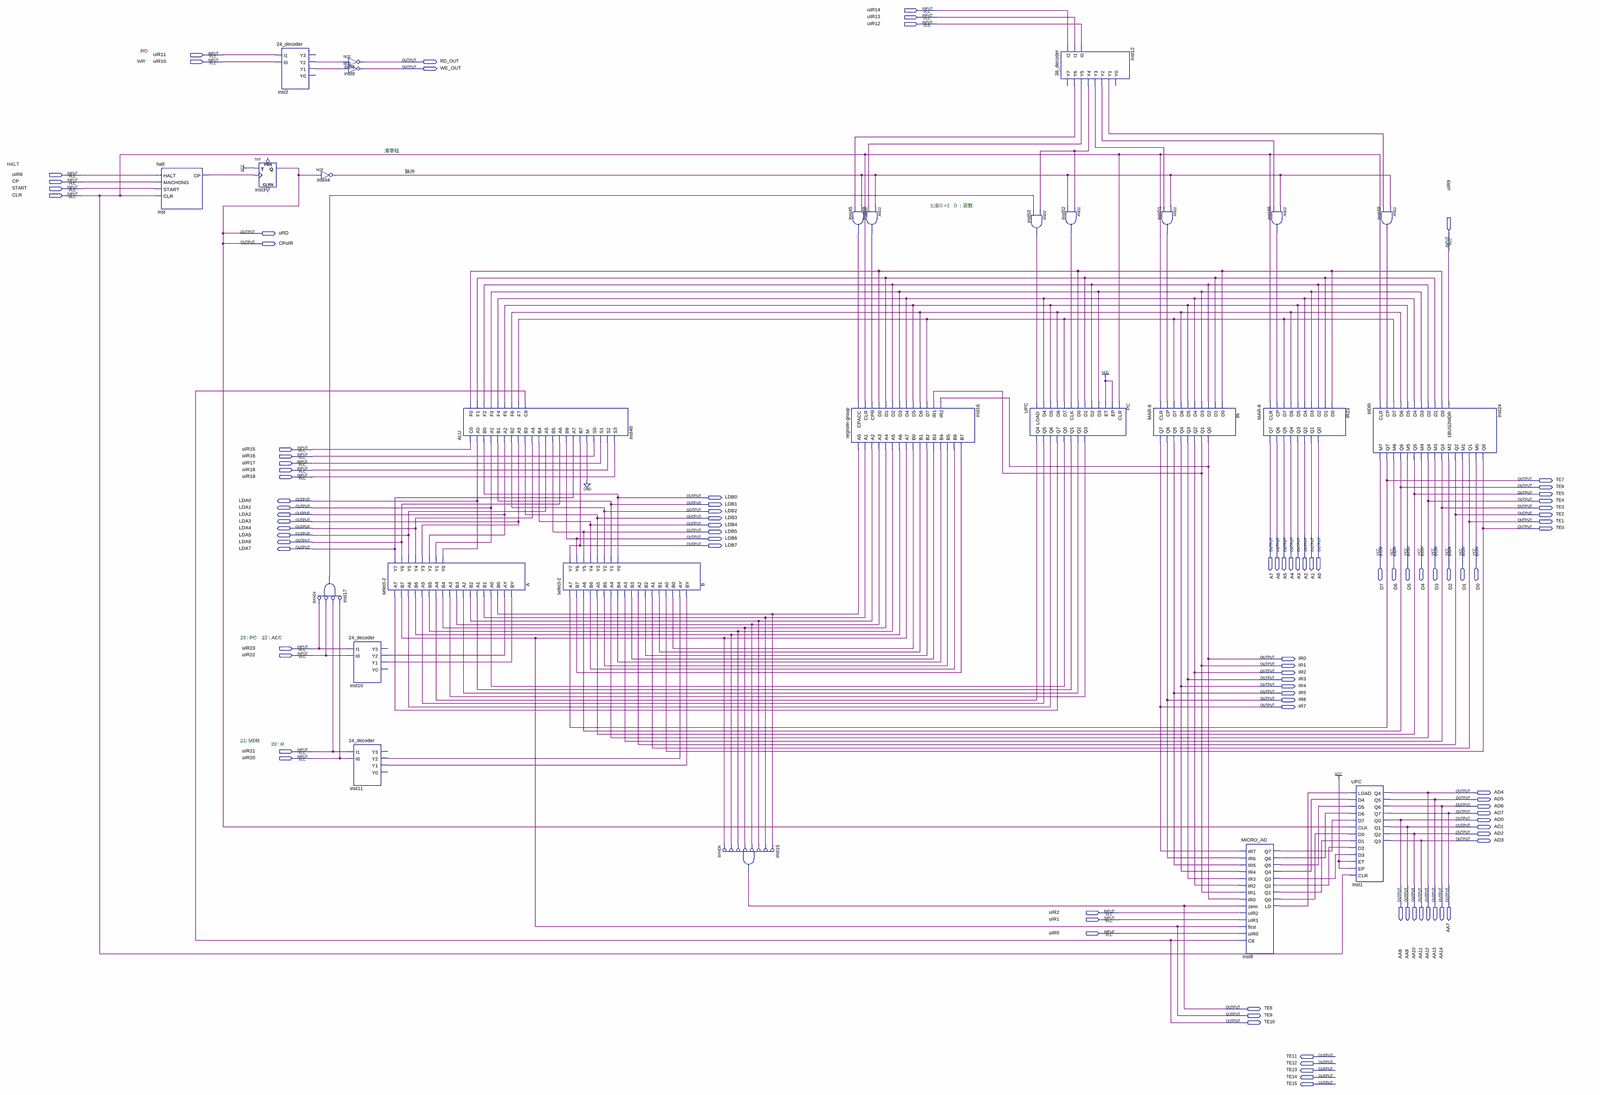
[diagram p0: schematic sheet, whole]
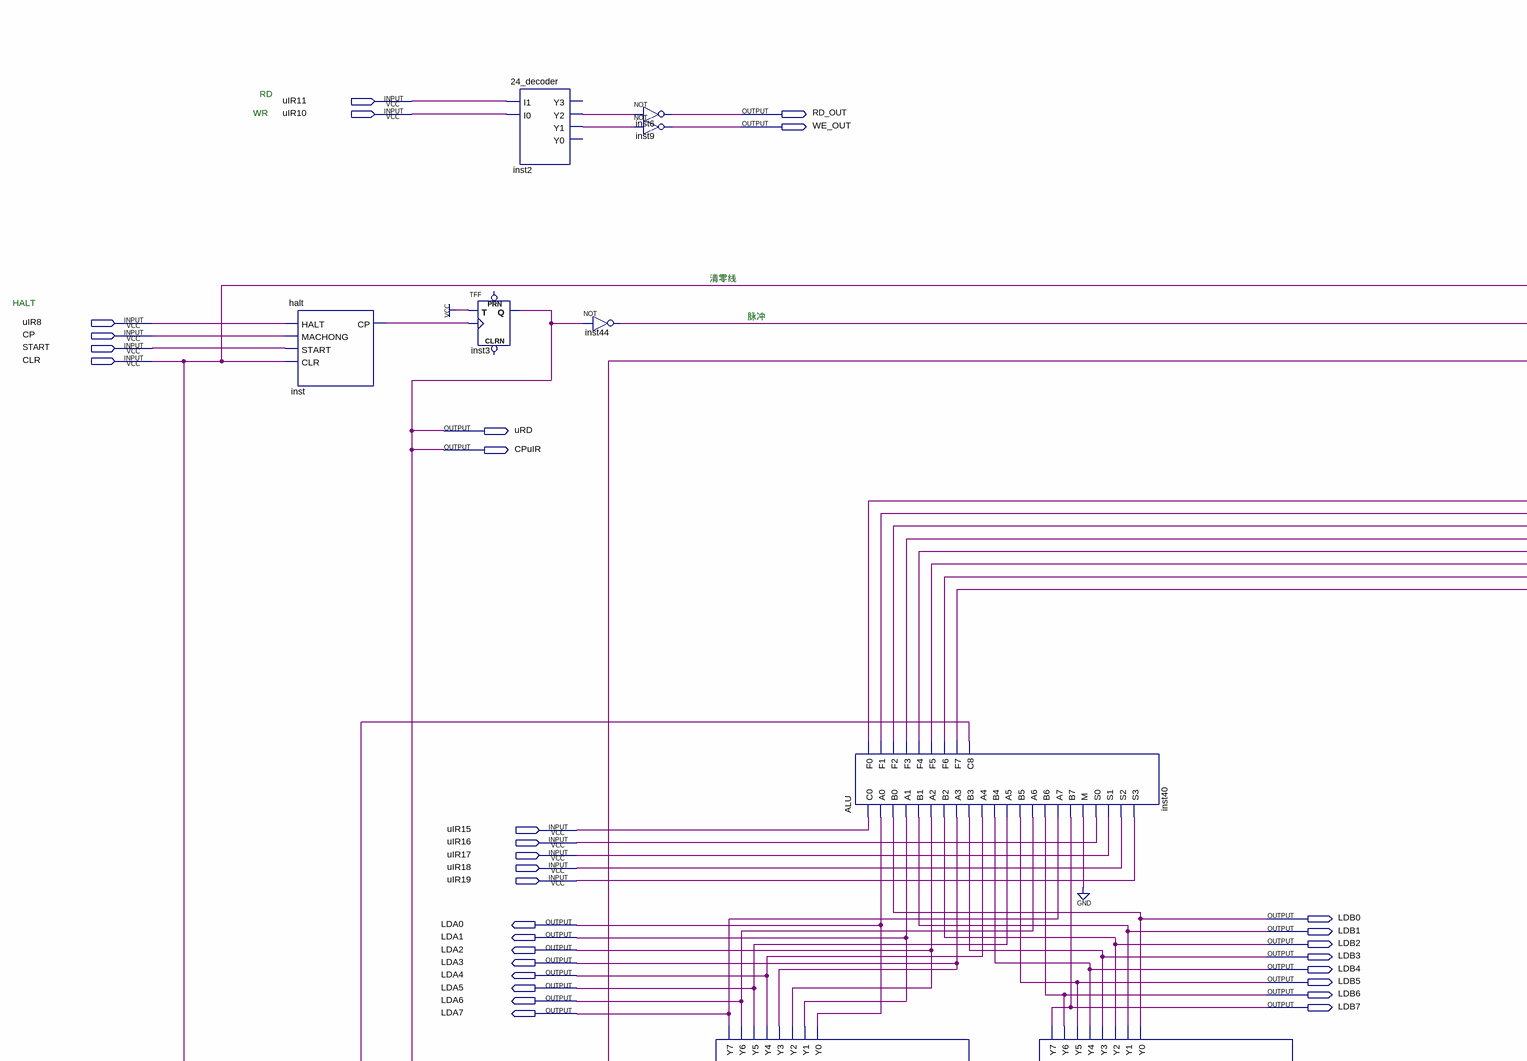
[diagram p1: schematic sheet, upper left part]
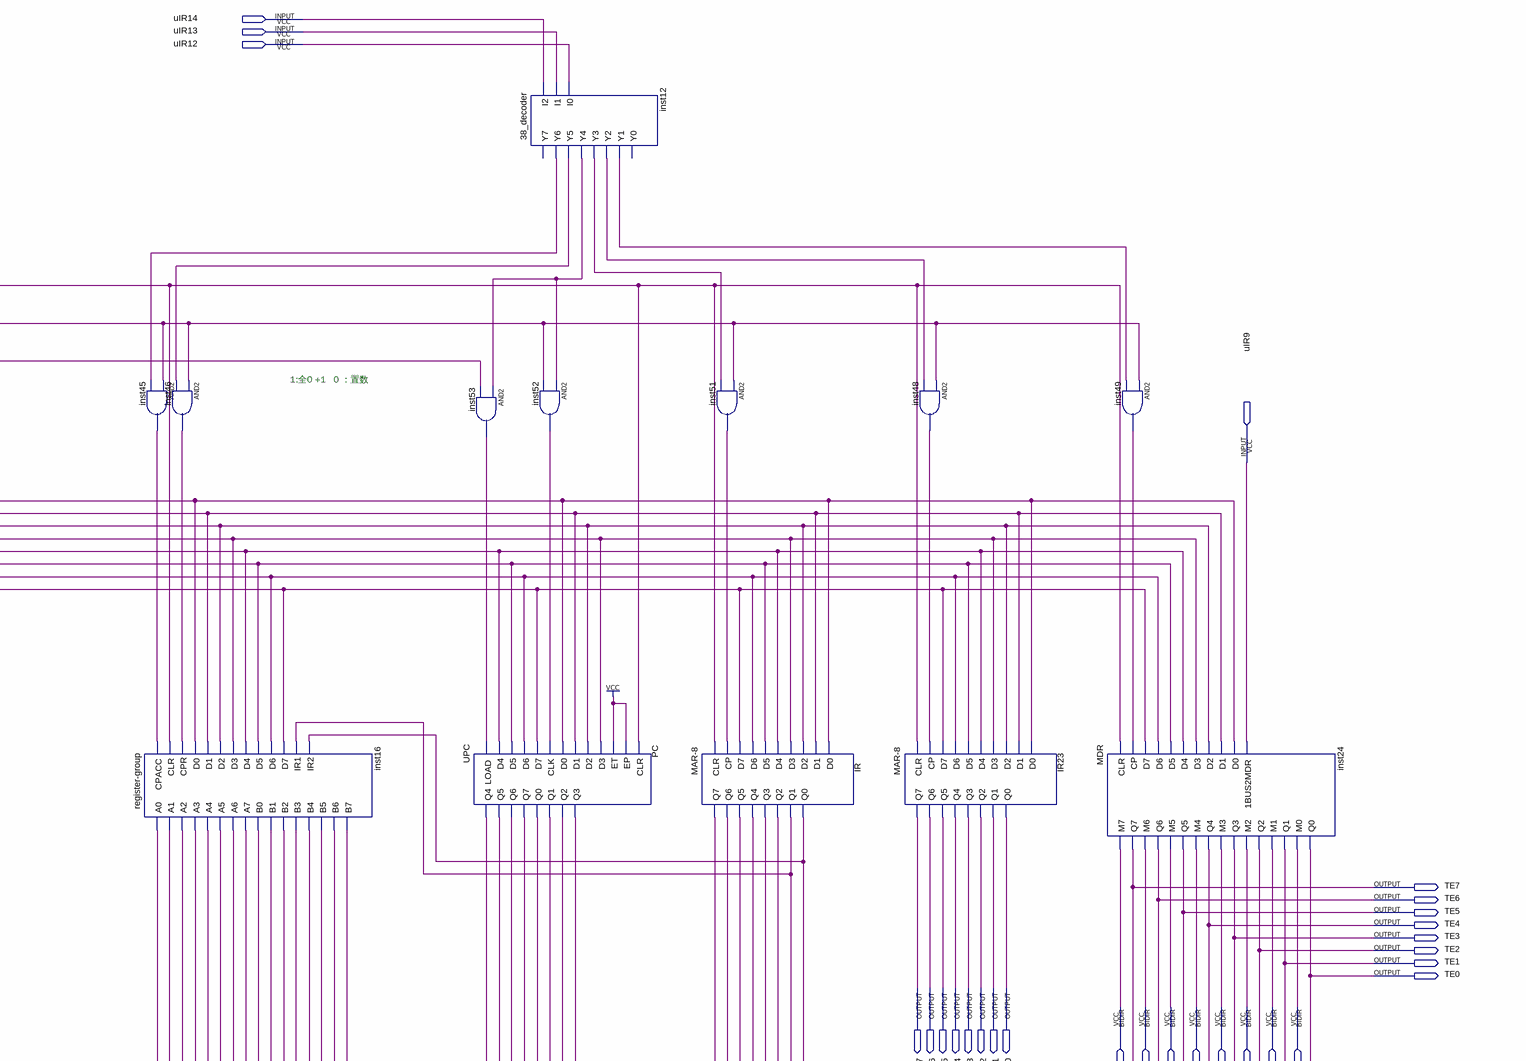
[diagram p2: schematic sheet, upper right part]
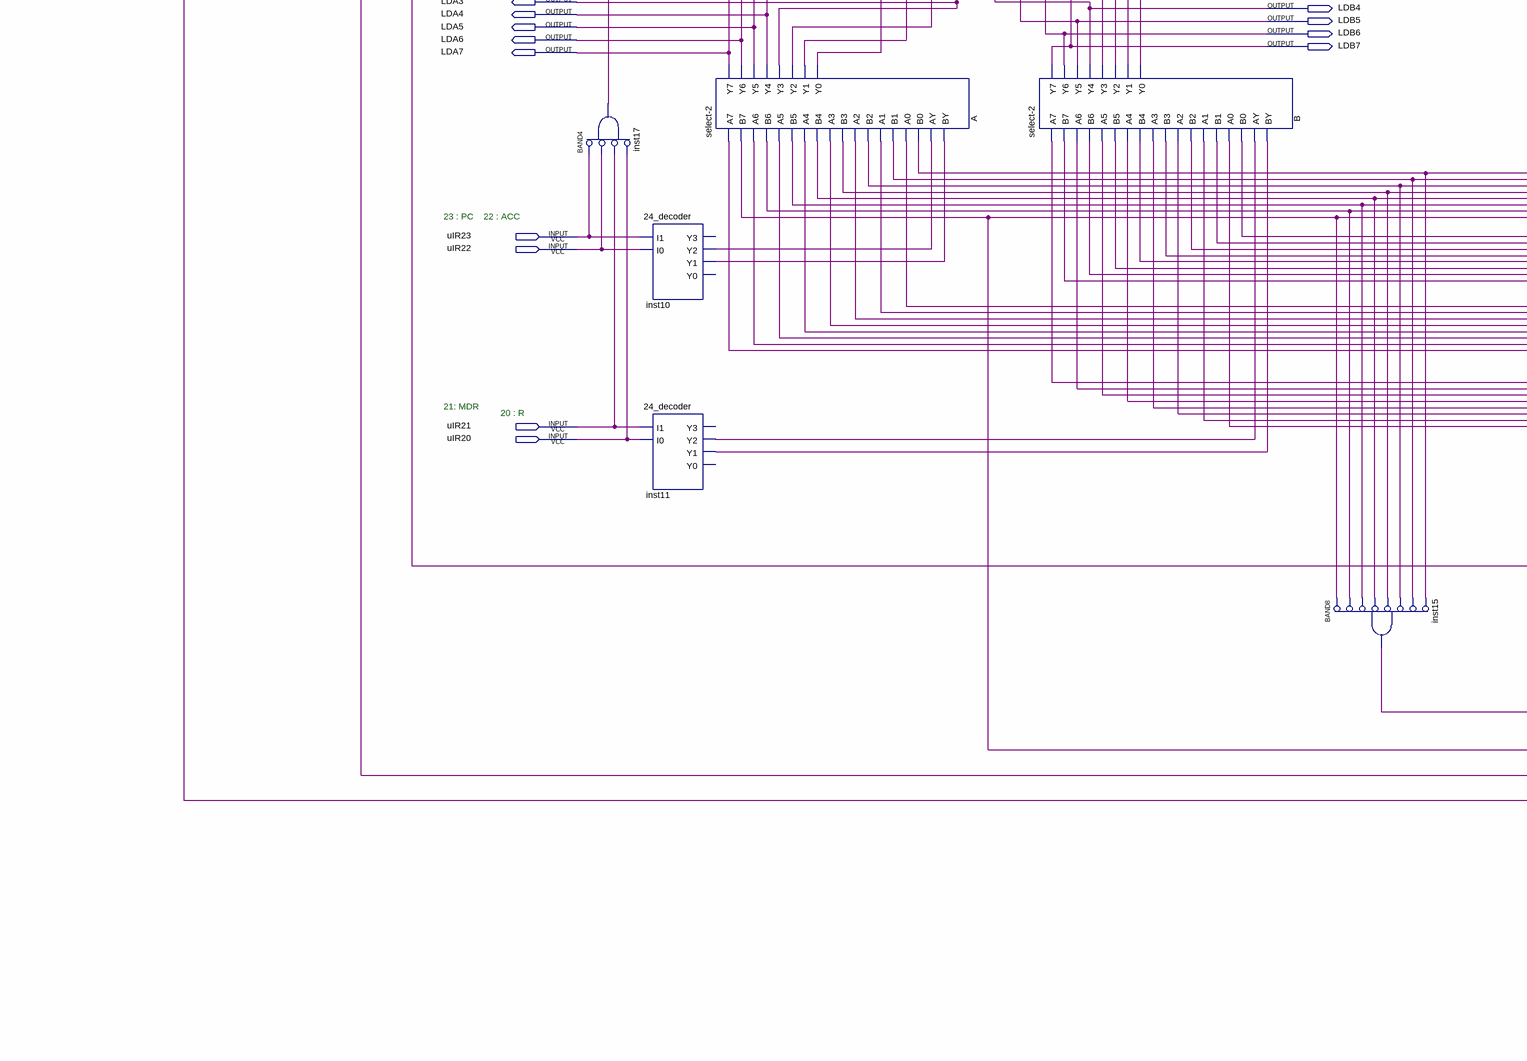
[diagram p3: schematic sheet, lower left part]
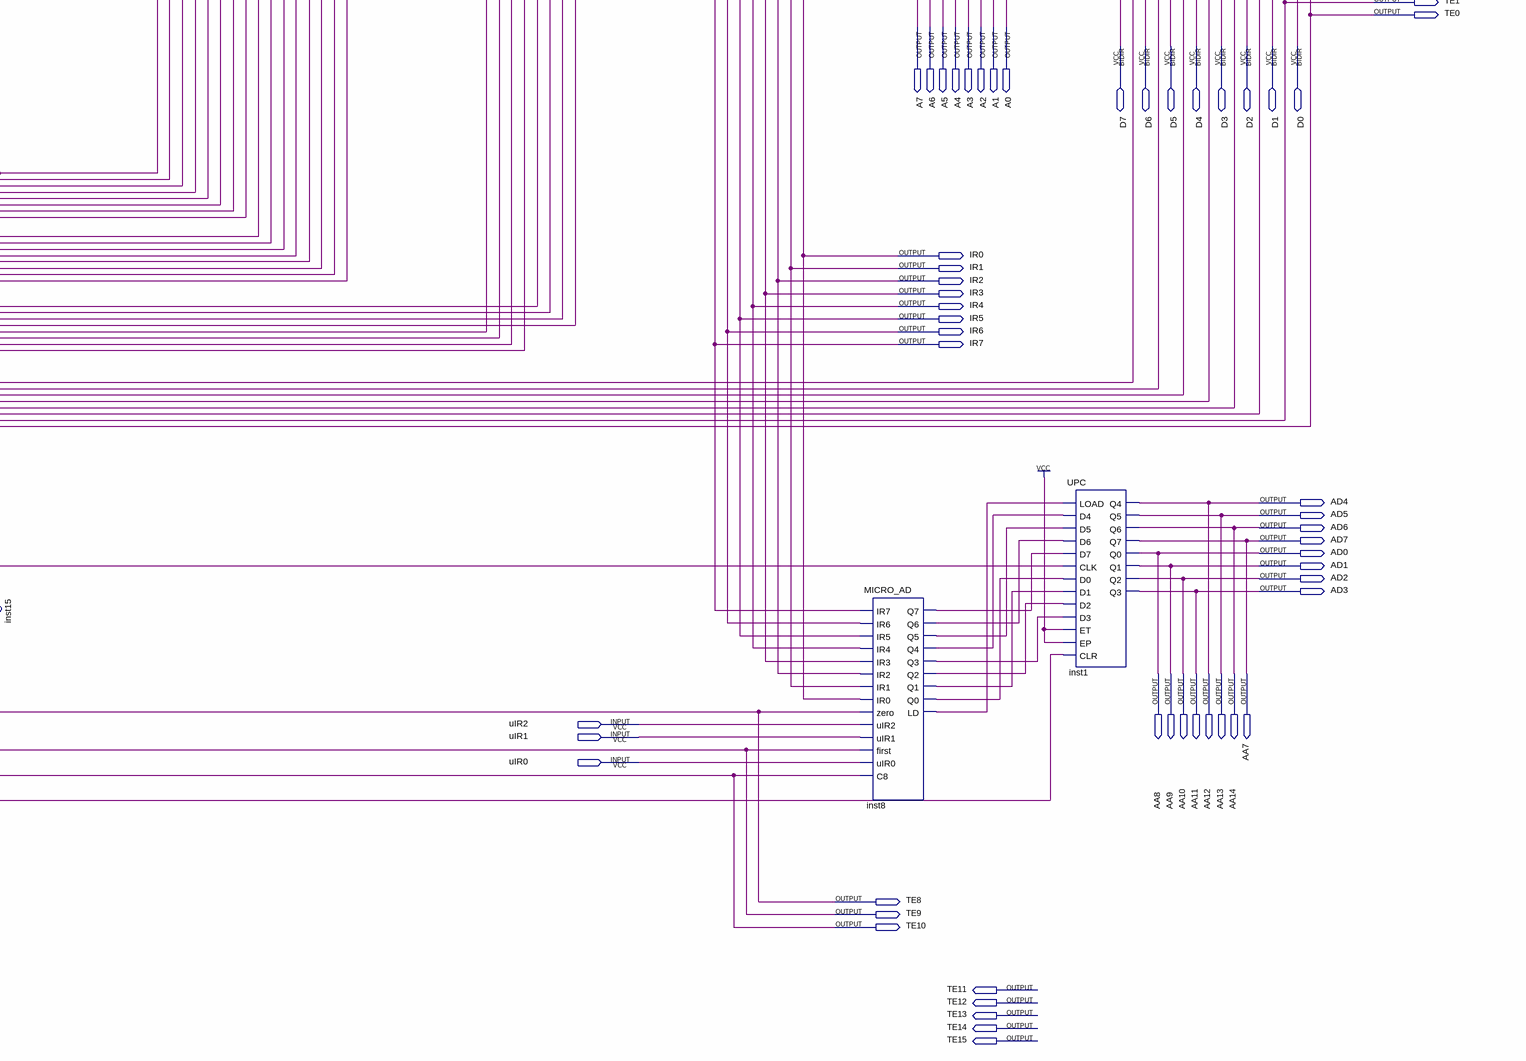
[diagram p4: schematic sheet, lower right part]
// Quartus schematic TOTAL.bdf as structural Verilog: 28 symbols, 98 pins
module TOTAL (
  input  uIR14,
  input  uIR13,
  input  uIR12,
  input  uIR11,
  input  uIR10,
  input  uIR8,
  input  CP,
  input  START,
  input  CLR,
  input  uIR9,
  input  uIR15,
  input  uIR16,
  input  uIR17,
  input  uIR18,
  input  uIR19,
  input  uIR23,
  input  uIR22,
  input  uIR21,
  input  uIR20,
  input  uIR2,
  input  uIR1,
  input  uIR0,
  inout  D7,
  inout  D6,
  inout  D5,
  inout  D4,
  inout  D3,
  inout  D2,
  inout  D1,
  inout  D0,
  output RD_OUT,
  output WE_OUT,
  output uRD,
  output CPuIR,
  output TE7,
  output TE6,
  output TE5,
  output LDB0,
  output LDA0,
  output TE4,
  output LDB1,
  output LDA1,
  output TE3,
  output LDB2,
  output LDA2,
  output TE2,
  output LDB3,
  output LDA3,
  output TE1,
  output LDB4,
  output LDA4,
  output TE0,
  output LDB5,
  output LDA5,
  output A7,
  output A6,
  output A5,
  output A4,
  output A3,
  output A2,
  output A1,
  output A0,
  output LDB6,
  output LDA6,
  output LDB7,
  output LDA7,
  output IR0,
  output IR1,
  output IR2,
  output IR3,
  output IR4,
  output IR5,
  output IR6,
  output IR7,
  output AD4,
  output AD5,
  output AD6,
  output AD7,
  output AD0,
  output AD1,
  output AD2,
  output AD3,
  output AA8,
  output AA9,
  output AA10,
  output AA11,
  output AA12,
  output AA13,
  output AA14,
  output AA7,
  output TE8,
  output TE9,
  output TE10,
  output TE11,
  output TE12,
  output TE13,
  output TE14,
  output TE15
);

  wire inst2_y1, inst2_y2, inst8_ld, inst8_q0, inst8_q1, inst8_q2, inst8_q3, inst8_q4, inst8_q5, inst8_q6,
       inst8_q7, inst10_y1, inst10_y2, inst11_y1, inst11_y2, inst12_y1, inst12_y2, inst12_y3, inst12_y4,
       inst12_y5, inst12_y6, inst16_a0, inst16_a1, inst16_a2, inst16_a3, inst16_a4, inst16_a5, inst16_a6,
       inst16_b0, inst16_b1, inst16_b2, inst16_b3, inst16_b4, inst16_b5, inst16_b6, inst16_b7, inst17_out,
       inst40_f0, inst40_f1, inst40_f2, inst40_f3, inst40_f4, inst40_f5, inst40_f6, inst40_f7, inst44_out,
       inst45_out, inst46_out, inst48_out, inst49_out, inst51_out, inst52_out, inst53_out, inst_cp, PC_q0,
       PC_q1, PC_q2, PC_q3, PC_q4, PC_q5, PC_q6, PC_q7;

  halt inst (.HALT(uIR8), .MACHONG(CP), .START(START), .CLR(CLR), .CP(inst_cp));
  TFF inst3 (.T(1'b1), .CLK(inst_cp), .Q(CPuIR));  // open: PRN, CLRN
  \24_decoder  inst2 (.I1(uIR11), .I0(uIR10), .Y2(inst2_y2), .Y1(inst2_y1));  // open: Y3, Y0
  not inst44 (inst44_out, CPuIR);
  and inst17 (inst17_out, ~uIR23, ~uIR22, ~uIR21, ~uIR20);  // BAND4
  not inst6 (RD_OUT, inst2_y2);
  not inst9 (WE_OUT, inst2_y1);
  \24_decoder  inst10 (.I1(uIR23), .I0(uIR22), .Y2(inst10_y2), .Y1(inst10_y1));  // open: Y3, Y0
  \24_decoder  inst11 (.I1(uIR21), .I0(uIR20), .Y2(inst11_y2), .Y1(inst11_y1));  // open: Y3, Y0
  \select-2  A (
    .A7(PC_q7), .B7(TE9), .A6(PC_q6), .B6(inst16_a6), .A5(PC_q5), .B5(inst16_a5), .A4(PC_q4), .B4(inst16_a4),
    .A3(PC_q3), .B3(inst16_a3), .A2(PC_q2), .B2(inst16_a2), .A1(PC_q1), .B1(inst16_a1), .A0(PC_q0),
    .B0(inst16_a0), .AY(inst10_y2), .BY(inst10_y1), .Y7(LDA7), .Y6(LDA6), .Y5(LDA5), .Y4(LDA4), .Y3(LDA3),
    .Y2(LDA2), .Y1(LDA1), .Y0(LDA0));
  ALU inst40 (
    .C0(uIR15), .A0(LDA0), .B0(LDB0), .A1(LDA1), .B1(LDB1), .A2(LDA2), .B2(LDB2), .A3(LDA3), .B3(LDB3),
    .A4(LDA4), .B4(LDB4), .A5(LDA5), .B5(LDB5), .A6(LDA6), .B6(LDB6), .A7(LDA7), .B7(LDB7), .M(1'b0),
    .S0(uIR16), .S1(uIR17), .S2(uIR18), .S3(uIR19), .F0(inst40_f0), .F1(inst40_f1), .F2(inst40_f2),
    .F3(inst40_f3), .F4(inst40_f4), .F5(inst40_f5), .F6(inst40_f6), .F7(inst40_f7), .C8(TE10));
  \select-2  B (
    .A7(TE7), .B7(inst16_b7), .A6(TE6), .B6(inst16_b6), .A5(TE5), .B5(inst16_b5), .A4(TE4), .B4(inst16_b4),
    .A3(TE3), .B3(inst16_b3), .A2(TE2), .B2(inst16_b2), .A1(TE1), .B1(inst16_b1), .A0(TE0), .B0(inst16_b0),
    .AY(inst11_y2), .BY(inst11_y1), .Y7(LDB7), .Y6(LDB6), .Y5(LDB5), .Y4(LDB4), .Y3(LDB3), .Y2(LDB2),
    .Y1(LDB1), .Y0(LDB0));
  and inst15 (TE8, ~TE9, ~inst16_a6, ~inst16_a5, ~inst16_a4, ~inst16_a3, ~inst16_a2, ~inst16_a1, ~inst16_a0);  // BAND8
  \register-group  inst16 (
    .CPACC(inst45_out), .CLR(CLR), .CPR(inst46_out), .D0(inst40_f0), .D1(inst40_f1), .D2(inst40_f2),
    .D3(inst40_f3), .D4(inst40_f4), .D5(inst40_f5), .D6(inst40_f6), .D7(inst40_f7), .IR1(IR1), .IR2(IR0),
    .A0(inst16_a0), .A1(inst16_a1), .A2(inst16_a2), .A3(inst16_a3), .A4(inst16_a4), .A5(inst16_a5),
    .A6(inst16_a6), .A7(TE9), .B0(inst16_b0), .B1(inst16_b1), .B2(inst16_b2), .B3(inst16_b3), .B4(inst16_b4),
    .B5(inst16_b5), .B6(inst16_b6), .B7(inst16_b7));
  and inst45 (inst45_out, inst44_out, inst12_y6);
  and inst46 (inst46_out, inst44_out, inst12_y5);
  and inst53 (inst53_out, inst12_y4, inst17_out);
  UPC PC (
    .LOAD(inst53_out), .D4(inst40_f4), .D5(inst40_f5), .D6(inst40_f6), .D7(inst40_f7), .CLK(inst52_out),
    .D0(inst40_f0), .D1(inst40_f1), .D2(inst40_f2), .D3(inst40_f3), .ET(1'b1), .EP(1'b1), .CLR(CLR),
    .Q4(PC_q4), .Q5(PC_q5), .Q6(PC_q6), .Q7(PC_q7), .Q0(PC_q0), .Q1(PC_q1), .Q2(PC_q2), .Q3(PC_q3));
  \38_decoder  inst12 (
    .I2(uIR14), .I1(uIR13), .I0(uIR12), .Y6(inst12_y6), .Y5(inst12_y5), .Y4(inst12_y4), .Y3(inst12_y3),
    .Y2(inst12_y2), .Y1(inst12_y1));  // open: Y7, Y0
  and inst52 (inst52_out, inst12_y4, inst44_out);
  \MAR-8  IR (
    .CLR(CLR), .CP(inst51_out), .D7(inst40_f7), .D6(inst40_f6), .D5(inst40_f5), .D4(inst40_f4),
    .D3(inst40_f3), .D2(inst40_f2), .D1(inst40_f1), .D0(inst40_f0), .Q7(IR7), .Q6(IR6), .Q5(IR5), .Q4(IR4),
    .Q3(IR3), .Q2(IR2), .Q1(IR1), .Q0(IR0));
  and inst51 (inst51_out, inst44_out, inst12_y3);
  \MAR-8  IR23 (
    .CLR(CLR), .CP(inst48_out), .D7(inst40_f7), .D6(inst40_f6), .D5(inst40_f5), .D4(inst40_f4),
    .D3(inst40_f3), .D2(inst40_f2), .D1(inst40_f1), .D0(inst40_f0), .Q7(A7), .Q6(A6), .Q5(A5), .Q4(A4),
    .Q3(A3), .Q2(A2), .Q1(A1), .Q0(A0));
  MICRO_AD inst8 (
    .IR7(IR7), .IR6(IR6), .IR5(IR5), .IR4(IR4), .IR3(IR3), .IR2(IR2), .IR1(IR1), .IR0(IR0), .zero(TE8),
    .uIR2(uIR2), .uIR1(uIR1), .first(TE9), .uIR0(uIR0), .C8(TE10), .Q7(inst8_q7), .Q6(inst8_q6),
    .Q5(inst8_q5), .Q4(inst8_q4), .Q3(inst8_q3), .Q2(inst8_q2), .Q1(inst8_q1), .Q0(inst8_q0), .LD(inst8_ld));
  and inst48 (inst48_out, inst44_out, inst12_y2);
  MDR inst24 (
    .CLR(CLR), .CP(inst49_out), .D7(inst40_f7), .D6(inst40_f6), .D5(inst40_f5), .D4(inst40_f4),
    .D3(inst40_f3), .D2(inst40_f2), .D1(inst40_f1), .D0(inst40_f0), .\1BUS2MDR (uIR9), .Q7(TE7), .Q6(TE6),
    .Q5(TE5), .Q4(TE4), .Q3(TE3), .Q2(TE2), .Q1(TE1), .Q0(TE0), .M7(D7), .M6(D6), .M5(D5), .M4(D4), .M3(D3),
    .M2(D2), .M1(D1), .M0(D0));
  UPC inst1 (
    .LOAD(inst8_ld), .D4(inst8_q4), .D5(inst8_q5), .D6(inst8_q6), .D7(inst8_q7), .CLK(CPuIR), .D0(inst8_q0),
    .D1(inst8_q1), .D2(inst8_q2), .D3(inst8_q3), .ET(1'b1), .EP(1'b1), .CLR(CLR), .Q4(AA12), .Q5(AA13),
    .Q6(AA14), .Q7(AA7), .Q0(AA8), .Q1(AA9), .Q2(AA10), .Q3(AA11));
  and inst49 (inst49_out, inst44_out, inst12_y1);

  assign AD0 = AA8;
  assign AD1 = AA9;
  assign AD2 = AA10;
  assign AD3 = AA11;
  assign AD4 = AA12;
  assign AD5 = AA13;
  assign AD6 = AA14;
  assign AD7 = AA7;
  assign uRD = CPuIR;

  // Notes on the sheet:
  //   RD
  //   WR
  //   清零线
  //   HALT
  //   脉冲
  //   1:全0 +1   0 ：置数
  //   23 : PC    22 : ACC
  //   21: MDR
  //   20 : R
endmodule
